# Altium schematic sheet Sheet ver1.SchDoc
size A; SheetNumber: 1; SheetTotal: 1; SPICEModelCacheADGMBXAL: <root> / <DocumentId>ADGMBXAL</DocumentId> / <CacheFrame Number="0"> / <Model Name="darlington_npn" Kind="CKT"> / <Text>*------------------------------------------------------------------------- / .SUBCKT Darlington_NPN C B E Params: / +subs=1 tnom=27 is=1e-16 bf=100 nf=1 vaf=0 ikf=0 / +ise=0 ne=1.5 br=1 nr=1 var=0 ikr=0 isc=0 nc=2 rb=0 / +irb=0 rbm=0 re=0 rc=0 cje=0 vje=0.75 mje=0.33 tf=0 / +xtf=0 vtf=0 itf=0 ptf=0 cjc=0 vjc=0.75 mjc=0.33 / +xcjc=1 tr=0 cjs=0 vjs=0.75 mjs=0 xtb=0 eg=1.11 xti=3 / +fc=0.5 kf=0 af=0 iss=0 ns=1 tlev=0 tlevc=0 tbf1=0 tbf2=0 / +tbr1=0 tbr2=0 tikf1=0 tikf2=0 tikr1=0 tikr2=0 tirb1=0 tirb2=0 / +tnc1=0 tnc2=0 tne1=0 tne2=0 tnf1=0 tnf2=0 tnr1=0 tnr2=0 / +trb1=0 trb2=0 trc1=0 trc2=0 tre1=0 tre2=0 trm1=0 trm2=0 / +tvaf1=0 tvaf2=0 tvar1=0 tvar2=0 ctc=0 cte=0 cts=0 tvjc=0 / +tvje=0 tvjs=0 titf1=0 titf2=0 ttf1=0 ttf2=0 ttr1=0 ttr2=0 / +tmje1=0 tmje2=0 tmjc1=0 tmjc2=0 tmjs1=0 tmjs2=0 tns1=0 tns2=0 / +nkf=0.5 tis1=0 tis2=0 tise1=0 tise2=0 tisc1=0 tisc2=0 vbe_max=1e99 / +vbc_max=1e99 vce_max=1e99 cn=0 d=0 gamma=0 qco=0 quasimod=0 / +rco=0 vg=0 vo=0 / *main_parameters IS RB RC RE CJC CJE CJS ISE ISC ISS / Q1 C B 1 NPN_Mod_Gummel_Poon / Q2 C 1 E NPN_Mod_Gummel_Poon / .model NPN_Mod_Gummel_Poon npn level=1 / + subs = {subs} tnom = {tnom} is = {is} bf = {bf} nf = {nf} vaf = {vaf} / +ikf = {ikf} ise = {ise} ne = {ne} br = {br} nr = {nr} var = {var} / +ikr = {ikr} isc = {isc} nc = {nc} rb = {rb} irb = {irb} rbm = {rbm} / +re = {re} rc = {rc} cje = {cje} vje = {vje} mje = {mje} tf = {tf} / +xtf = {xtf} vtf = {vtf} itf = {itf} ptf = {ptf} cjc = {cjc} vjc = {vjc} / +mjc = {mjc} xcjc = {xcjc} tr = {tr} cjs = {cjs} vjs = {vjs} mjs = {mjs} / +xtb = {xtb} eg = {eg} xti = {xti} fc = {fc} kf = {kf} af = {af}  iss = {iss} / +ns = {ns} tlev = {tlev} tlevc = {tlevc} tbf1 = {tbf1} tbf2 = {tbf2} / +tbr1 = {tbr1} tbr2 = {tbr2} tikf1 = {tikf1} tikf2 = {tikf2} tikr1 = {tikr1} / + tikr2 = {tikr2} tirb1 = {tirb1} tirb2 = {tirb2} tnc1 = {tnc1} tnc2 = {tnc2} / +tne1 = {tne1} tne2 = {tne2} tnf1 = {tnf1} tnf2 = {tnf2} tnr1 = {tnr1} / +tnr2 = {tnr2}  trb1 = {trb1} trb2 = {trb2} trc1 = {trc1} trc2 = {trc2} / +tre1 = {tre1} tre2 = {tre2} trm1 = {trm1} trm2 = {trm2} tvaf1 = {tvaf1} / +tvaf2 = {tvaf2} tvar1 = {tvar1}  tvar2 = {tvar2} ctc = {ctc} cte = {cte} / +cts = {cts} tvjc = {tvjc} tvje = {tvje} tvjs = {tvjs} titf1 = {titf1} / +titf2 = {titf2} ttf1 = {ttf1} ttf2 = {ttf2} ttr1 = {ttr1} ttr2 = {ttr2} / +tmje1 = {tmje1} tmje2 = {tmje2} tmjc1 = {tmjc1} tmjc2 = {tmjc2} tmjs1 = {tmjs1} / +tmjs2 = {tmjs2} tns1 = {tns1} tns2 = {tns2} nkf = {nkf} tis1 = {tis1} / +tis2 = {tis2} tise1 = {tise1} tise2 = {tise2} tisc1 = {tisc1} tisc2 = {tisc2} / +vbe_max = {vbe_max} vbc_max = {vbc_max} vce_max = {vce_max} cn = {cn} d = {d} / +gamma = {gamma} qco = {qco} quasimod = {quasimod} rco = {rco} vg = {vg} vo = {vo} / .ENDS</Text> / </Model> / </CacheFrame> / </root>
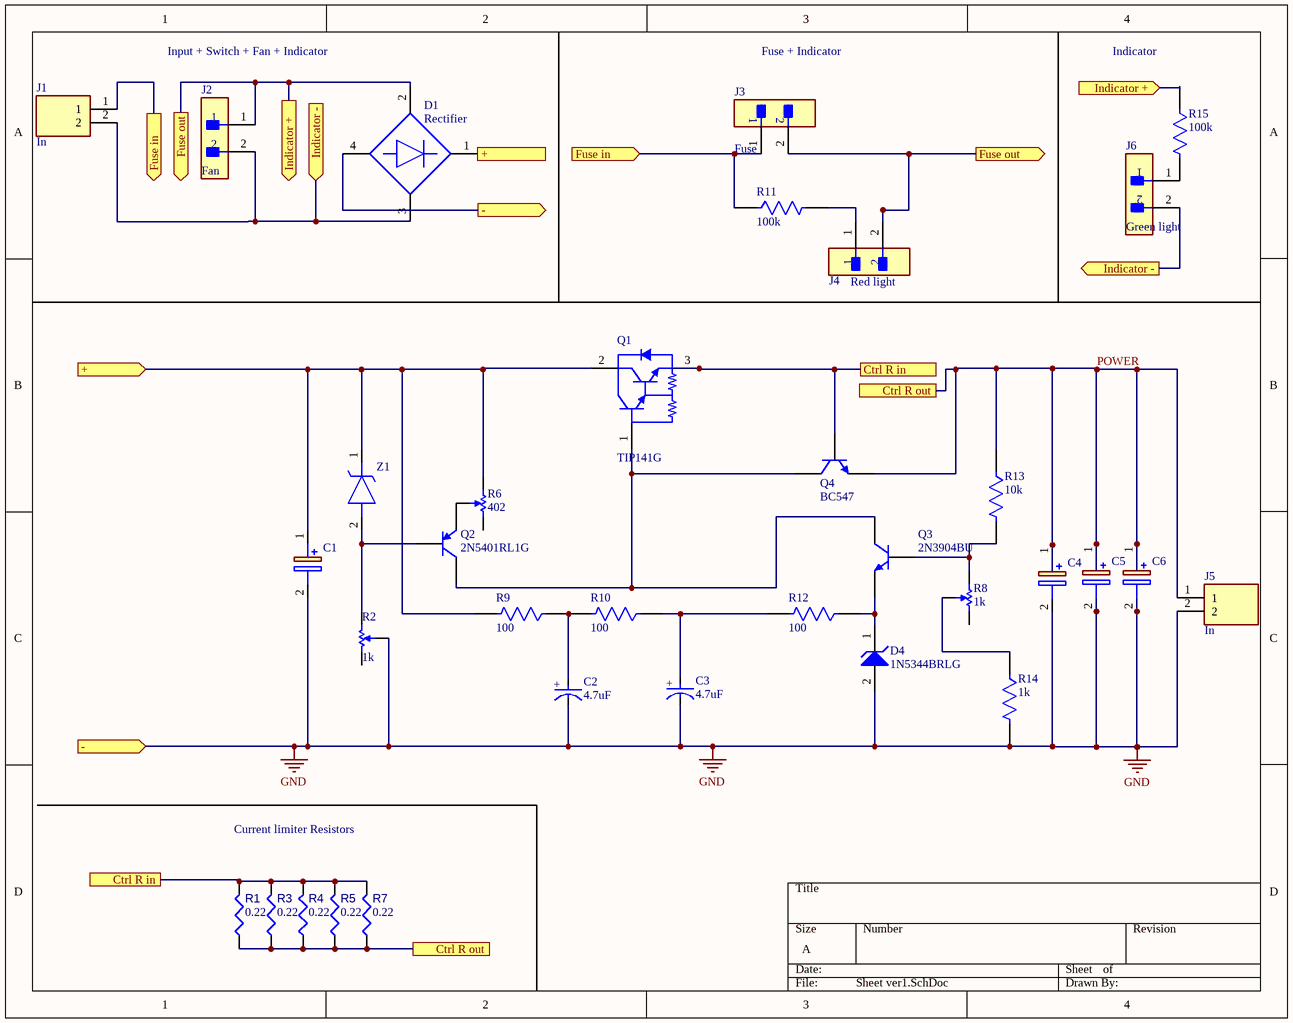
[diagram p0: Sheet ver1.SchDoc]

## Parts
C1  ESK478M050AQ3AA  [CAPPRD1000W80D2200H3700]  (value not drawn)
C2  4.7uF  [FP-RAD-TH-D_5_0_5-L_11_1-MFG]
C3  4.7uF  [FP-RAD-TH-D_5_0_5-L_11_1-MFG]
C4  ESK478M050AQ3AA  [CAPPRD1000W80D2200H3700]  (value not drawn)
C5  ESK478M050AQ3AA  [CAPPRD1000W80D2200H3700]  (value not drawn)
C6  ESK478M050AQ3AA  [CAPPRD1000W80D2200H3700]  (value not drawn)
D1  Rectifier  [FP-160AD-MFG]
D4  1N5344BRLG  [ONSC-SURMETIC40-2-017AA-01]
J1  In  [1935161]
J2  Fan  [FP-B2B-XH-A_LF_SN-MFG]
J3  Fuse  [FP-B2B-XH-A_LF_SN-MFG]
J4  Red light  [FP-B2B-XH-A_LF_SN-MFG]
J5  In  [1935161]
J6  Green light  [FP-B2B-XH-A_LF_SN-MFG]
Q1  TIP141G  [ONSC-TO-247-3-340L-02]
Q2  2N5401RL1G  [ONSC-TO-92-3-29-11_AM_BL]
Q3  2N3904BU  [FAIR-TO-92]
Q4  BC547  [FAIR-TO-92]
R1  value 0.22  [SQMW5R22J-Footprint-1]  (hidden comment: SQMW5R22J re1)
R2  1k  [BOUR-3296W-1-3]
R3  value 0.22  [SQMW5R22J-Footprint-1]  (hidden comment: SQMW5R22J re1)
R4  value 0.22  [SQMW5R22J-Footprint-1]  (hidden comment: SQMW5R22J re1)
R5  value 0.22  [SQMW5R22J-Footprint-1]  (hidden comment: SQMW5R22J re1)
R6  402  [BOUR-3296W-1-3]
R7  value 0.22  [SQMW5R22J-Footprint-1]  (hidden comment: SQMW5R22J re1)
R8  1k  [BOUR-3296W-1-3]
R9  100  [FP-HVR37-MFG]
R10  100  [FP-HVR37-MFG]
R11  100k  [FP-HVR37-MFG]
R12  100  [FP-HVR37-MFG]
R13  10k  [FP-HVR37-MFG]
R14  1k  [FP-HVR37-MFG]
R15  100k  [FP-HVR37-MFG]
Z1  1N4728A-TAP  [DIOAD1310W86L370D235]  (value not drawn)

## Ports
+ (in, see Sheet ver1[2A]), + (out, see Sheet ver1[1B]), - (in, see Sheet ver1[2A]), - (out, see Sheet ver1[1C]), Ctrl R in (see Sheet ver1[1D]), Ctrl R in (see Sheet ver1[3B]), Ctrl R out (see Sheet ver1[2D]), Ctrl R out (see Sheet ver1[3B]), Fuse in (in, see Sheet ver1[1A]), Fuse in (out, see Sheet ver1[2A]), Fuse out (out, see Sheet ver1[1A]), Fuse out (out, see Sheet ver1[4A]), Indicator + (in, see Sheet ver1[1A]), Indicator + (out, see Sheet ver1[4A]), Indicator - (in, see Sheet ver1[4B]), Indicator - (out, see Sheet ver1[1A])

## Nets
GND: C1.2(-) C2.1(C) C3.1(C) C4.2(-) C5.2(-) C6.2(-) D1.4(-) D4.2(A) J5.2 R2.3(TAP) R14.2 ; port -
+: C1.1(+) D1.1(+) Q1.2(C) R6.1(A) R9.2 Z1.1(K) ; port +
Ctrl R in: Q1.3(E) Q4.2(B) R1.2 R3.2 R4.2 R5.2 R7.2 ; port Ctrl R in
Fuse in: J1.1 J3.1 R11.1 ; port Fuse in
Fuse out: D1.2(1_~) J2.1 J3.2 J4.2 R15.1 ; port Fuse out, port Indicator +
Indicator -: D1.3(2_~) J1.2 J2.2 J6.2 ; port Indicator -
POWER: C4.1(+) C5.1(+) C6.1(+) J5.1 Q4.1(E) R1.1 R3.1 R4.1 R5.1 R7.1 R13.1 ; port Ctrl R out
NetC2_2: C2.2(A) R9.1 R10.2
NetC3_2: C3.2(A) R10.1 R12.2
NetD4_1: D4.1(K) Q3.1(E) R12.1
NetJ4_1: J4.1 R11.2
NetJ6_1: J6.1 R15.2
NetQ1_1: Q1.1(B) Q2.3(C) Q3.3(C) Q4.3(C)
NetQ2_1: Q2.1(E) R6.3(TAP)
NetQ2_2: Q2.2(B) R2.1(A) Z1.2(A)
NetQ3_2: Q3.2(B) R8.1(A) R13.2
NetR8_3: R8.3(TAP) R14.1

Not connected (* = marked no-connect by the designer): R2 2(B); R6 2(B); R8 2(B)

## Notes on the sheet
- Input + Switch + Fan + Indicator
- Fuse + Indicator
- Indicator
- Current limiter Resistors
- (in symbol CMP-05427-000256-1) +

## Library data of the parts
C1 C4-C6 = ESK478M050AQ3AA: Capacitor Polarised; Manufacturer_Name: KEMET; Datasheet Link: https://content.kemet.com/datasheets/KEM_A4004_ESK.pdf; Height: 37mm; Manufacturer_Part_Number: ESK478M050AQ3AA; Mouser Part Number: 80-ESK478M050AQ3AA; Mouser Price/Stock: https://www.mouser.co.uk/ProductDetail/KEMET/ESK478M050AQ3AA?qs=gt1LBUVyoHl7SM9dsUCJjA%3D%3D
C2 C3 = CMP-05427-000256-1: Aluminum Electrolytic Capacitors (Radial Lead Type) AEC-Q200 Qualified 4.7uF ±20% 50V; Polarity: Polar; Lead Diameter: 0.5mm; Life (Hours): 1000Hour; Impedance: 1.3R; Ripple Current: 95mA; Length: 11mm; Package Quantity: 2000; Voltage Rating (DC): 50V; Max Operating Temperature: 105°C; RoHS Compliant: Yes; Series: FC; Packaging: Ammo Pack; Voltage Rating: 50V; Lead Pitch: 2.5mm; Tolerance: 20%; Capacitance: 4.7uF; Case/Package: Radial; Contact Plating: Tin; Termination: Radial; Height: 11mm; Ratings: AEC-Q200; Radiation Hardening: No; Diameter: 5mm; ESR (Equivalent Series Resistance): 1.3R; Min Operating Temperature: -55°C; Mount: Through Hole; Features: General Purpose; Height - Seated (Max): 0.472inch
D1 = CMP-00278-23026262-1: GBPC3506 GBPC3506 Series 35 A 600 V Bridge Rectifier Quick Connect - GBPC-4; Manufacturer Lifecycle Status: ACTIVE, NOT REC; Output Current: 35A; Capacitance: 180pF; Peak Non-Repetitive Surge Current: 400A; Power Dissipation: 83.3W; Max Reverse Leakage Current: 5µA; Max Repetitive Reverse Voltage (Vrrm): 600V; Element Configuration: Single; Forward Voltage: 1.1V; Number of Elements: 1; Width: 29mm; Current Rating: 35A; Radiation Hardening: No; Mount: Screw; REACH SVHC: No SVHC; Packaging: Bulk; NexarPartId: 23026262; Height: 11.23mm; Number of Pins: 4; Lead Free: Lead Free; Length: 29mm; Max Operating Temperature: 150°C; Voltage Rating (DC): 600V; Peak Reverse Current: 5µA; RoHS: Compliant; Average Rectified Current: 35A; Schedule B: 8541100080, 8541100080; Weight: 16.74g; Lifecycle Status: NRND; Forward Current: 35A; Max Forward Surge Current (Ifsm): 400A; Case/Package: Module; Max Surge Current: 400A; Min Operating Temperature: -55°C
D4 = CMP-1060-01306-1: 5 W Zener Voltage Regulator, 2-Pin Surmetic(TM) 40, Pb-Free, Tape and Reel; Manufacturer: On Semiconductor; VZ Typ (V): 8.2; P Max (W): 5; RoHS: Pb-Free; PackageVersion: Rev. O, 09/2005; ComponentLink3URL: http://www.onsemi.cn/pub_link/Collateral/017AA.PDF; PackageReference: SURMETIC40-2-017AA-01; PackageDescription: 2-Pin, Axial Lead, Diameter 3.49 mm; DatasheetVersion: Rev. 14; ComponentLink1Description: Manufacturer URL; ComponentLink2URL: http://www.onsemi.cn/pub_link/Collateral/1N5333B-D.PDF; ComponentLink2Description: Datasheet; ComponentLink3Description: Package Specification; Mounting Technology: Through Hole; ComponentLink1URL: http://www.onsemi.com/; PartNumber: 1N5344BRLG; Packing: Tape and Reel
J1 J5 = 1935161: Connector; Manufacturer_Name: Phoenix Contact; Datasheet Link: https://datasheet.datasheetarchive.com/originals/distributors/SFDatasheet-2/sf-00057459.pdf; Height: 11.55mm; Manufacturer_Part_Number: 1935161; Mouser Part Number: 651-1935161; Mouser Price/Stock: https://www.mouser.co.uk/ProductDetail/Phoenix-Contact/1935161?qs=W3wJikR1%252BS6eKzfFl8Rbew%3D%3D; Arrow Part Number: 1935161; Arrow Price/Stock: https://www.arrow.com/en/products/1935161/phoenix-contact?region=nac
J2-J4 J6 = CMP-2000-05888-3: CONN HEADER VERT 2POS 2.5MM; Current Rating: 3A; Voltage Rating: 250V; Number of Contacts: 2; Contact Resistance: 20mR; Wire/Cable Gauge: 22AWG; Insulation Resistance: 1GR; Connector Type: Male Pin; Packaging: Bulk; Contact Material: Brass; Lead Free: Lead Free; Orientation: Straight; Contact Plating: Tin; Max Current Rating: 3A; Termination: Solder; Fastening Type: Detent; Depth: 5.75mm; Housing Material: Polyamide; REACH SVHC: No SVHC; Series: XH; Voltage Rating (AC): 250V; Number of Positions: 2; Color: Natural; Contact Type: Male Pin; Max Voltage Rating (DC): 250V; Pitch: 2.5mm; Lead Pitch: 2.5mm; Mount: Through Hole; Max Operating Temperature: 85°C; Length: 7.4mm; Max Voltage Rating (AC): 250V; Min Operating Temperature: -25°C; Number of Rows: 1; Housing Color: White
Q1 = CMP-1047-00196-1: Darlington Complementary Silicon Power Transistor, 3-Pin TO-247, Pb-Free, Tube; Manufacturer: On Semiconductor; Polarity: NPN; IC Continuous (A): 10; PackageDescription: 3-Pin Flange Mount, Vertical Straight Lead, Body 16.005 x 5 mm, Pitch 5.45 mm; ComponentLink2Description: Datasheet; RoHS: TRUE; Packing: Tube; PartNumber: TIP141G; ComponentLink1URL: http://www.onsemi.com/; Mounting Technology: Through Hole; PackageVersion: Rev. F, 10/2011; ComponentLink1Description: Manufacturer URL; ComponentLink2URL: http://www.onsemi.cn/pub_link/Collateral/TIP140-D.PDF; ComponentLink3Description: Package Specification; PackageReference: TO-247-3-340L-02; DatasheetVersion: Rev. 6; ComponentLink3URL: http://www.onsemi.cn/pub_link/Collateral/340L-02.PDF
Q2 = CMP-1048-01488-1: Amplifier Transistor, PNP Silicon, 3-Pin TO-92, Pb-Free, Tape and Reel; Manufacturer: On Semiconductor; IC Continuous (A): 0.6; fT Min (MHz): 100; Packing: Tape and Reel; Mounting Technology: Through Hole; ComponentLink2URL: http://www.onsemi.com/pub_link/Collateral/2N5401-D.PDF; PackageReference: TO-92-3-29-11_AM_BL; RoHS: TRUE; DatasheetVersion: Rev. 4; Polarity: PNP; PartNumber: 2N5401RL1G; PackageVersion: Rev. AM; ComponentLink2Description: Datasheet; PackageDescription: 3-Pin Transistor Outline, Body 4.825 x 3.685 mm, Pitch 1.27 mm; ComponentLink1Description: Manufacturer URL; ComponentLink1URL: http://www.onsemi.com/; ComponentLink3Description: Package Specification; ComponentLink3URL: http://www.onsemi.com/pub_link/Collateral/MAC97-D.PDF
Q3 Q4 = CMP-2000-04944-1: NPN General-Purpose Amplifier, 40 V VCEO, 0.2 A, -55 to 150 degC, 2-Pin TO-92, RoHS, Bulk; Manufacturer: FairchildSemiconductor; Maximum Collector Base Voltage: 60V; Minimum DC Current Gain: 40@0.1mA@1V; Maximum Collector Emitter Voltage: 40V; Maximum DC Collector Current: 0.2A; Rad Hard: No; Maximum Operating Frequency: 300(Min)MHz; Maximum Collector Emitter Saturation Voltage: 0.2@1mA@10mA; Maximum Power Dissipation: 625mW; Package Description: 3-Pin Transistor Outline Package, Body Dia 4.79 mm, Pitch 1.27 mm; Package Reference: TO-92; Pin Count: 3; Operating Temperature: -55to150degC; Category: GPBJT; Manufacturer URL: https://www.fairchildsemi.com/; Datasheet URL: https://datasheet.ciiva.com/4722/2n3904-82270-4722369.pdf; Package: 3TO-92; Packaging: Bulk; Type: NPN; Datasheet Version: Rev. 1.1.0, 10/2014; Mounting: ThroughHole
R1 R3-R5 R7 = CMP-009-00182-1: Fixed Resistor, Wire Wound, 5W, 0.22ohm, 5% +/-Tol, 300ppm/Cel, Through Hole Mount, 5135; Tolerance: 5%; RoHS Compliant: Yes; Case/Package: 5135; Power: 5W; Min Operating Temperature: -55°C; Mounting Technology: Through Hole; Pins: 2; Max Operating Temperature: 250°C
R2 R6 R8 = CMP-1747-00002-1: Square Trimpot(R) Trimming Potentiometer, 1000 Ohm, -55 to 125 degC, 3-Pin THD, RoHS, Tube; Case\Package: 0603; Tolerance: 1%; Power Rating: 100 mW; Voltage Rating: 75 V; Resistance: 4.7 kohm; Value: 4.7 kohm; ComponentLink2URL: http://www.bourns.com/docs/Product-Datasheets/3296.pdf; Packaging: Tape and Reel; REACH SVHC: Yes; ComponentLink1URL: http://www.bourns.com/; Case Code (Metric): 1608; Width: 0.8 mm; ComponentLink1Description: Manufacturer URL; DatasheetVersion: May-16; Max Operating Temperature: 155 degC; PackageReference: 3296W-1-3; PackageDescription: 3-Pin Through Hole Device, Body 9.53 x 4.83 mm, Pitch 2.54 mm; Weight: 7.1E-05 oz; ComponentLink2Description: Datasheet; RoHSCompliant: true; Min Operating Temperature: -55 degC; Radiation Hardening: No; Case Code (Imperial): 0603; Length: 1.6 mm; Package Quantity: 5000; Pins: 2; Mount: Surface Mount; Height: 0.45 mm
R9-R15 = CMP-00030-42845042-1: HVR3700001004FR500 Fixed Resistor, Metal Film, 0.5W, 1000000ohm, 3500V, 1% +/-Tol, 200ppm/Cel, Through Hole Mount; Resistance: 1MΩ; Voltage Rating: 3.5kV; Max Power Dissipation: 500mW; Lead Diameter: 780µm; Temperature Coefficient: 200ppm/°C; Number of Pins: 2; Composition: Metal Film; Features: Flame Retardant Coating; Schedule B: 8533210090, 8533210090; RoHS: Compliant; Voltage Rating (DC): 3.5kV; Min Operating Temperature: -55°C; REACH SVHC: Unknown; Tolerance: 1%; Termination: Axial; Radiation Hardening: No; Height: 4mm; Packaging: Cut Tape (CT); Length: 10.0076mm; Number of Terminations: 2; Max Operating Temperature: 155°C; Power Rating: 500mW; NexarPartId: 42845042; Lead Free: Lead Free; Case/Package: Axial
Z1 = 1N4728A-TAP: Zener Diode; Manufacturer_Name: Vishay; Datasheet Link: http://www.vishay.com/docs/85816/1n4728a.pdf; Manufacturer_Part_Number: 1N4728A-TAP; Mouser Part Number: 78-1N4728A-TAP; Mouser Price/Stock: https://www.mouser.co.uk/ProductDetail/Vishay-Semiconductors/1N4728A-TAP?qs=jOv7F9L7VbhWbv%2Fx6WHg%2FA%3D%3D; Arrow Part Number: 1N4728A-TAP; Arrow Price/Stock: https://www.arrow.com/en/products/1n4728a-tap/vishay?region=nac